# Altium schematic sheet smartGarden_COM_Rev01.SchDoc
size A
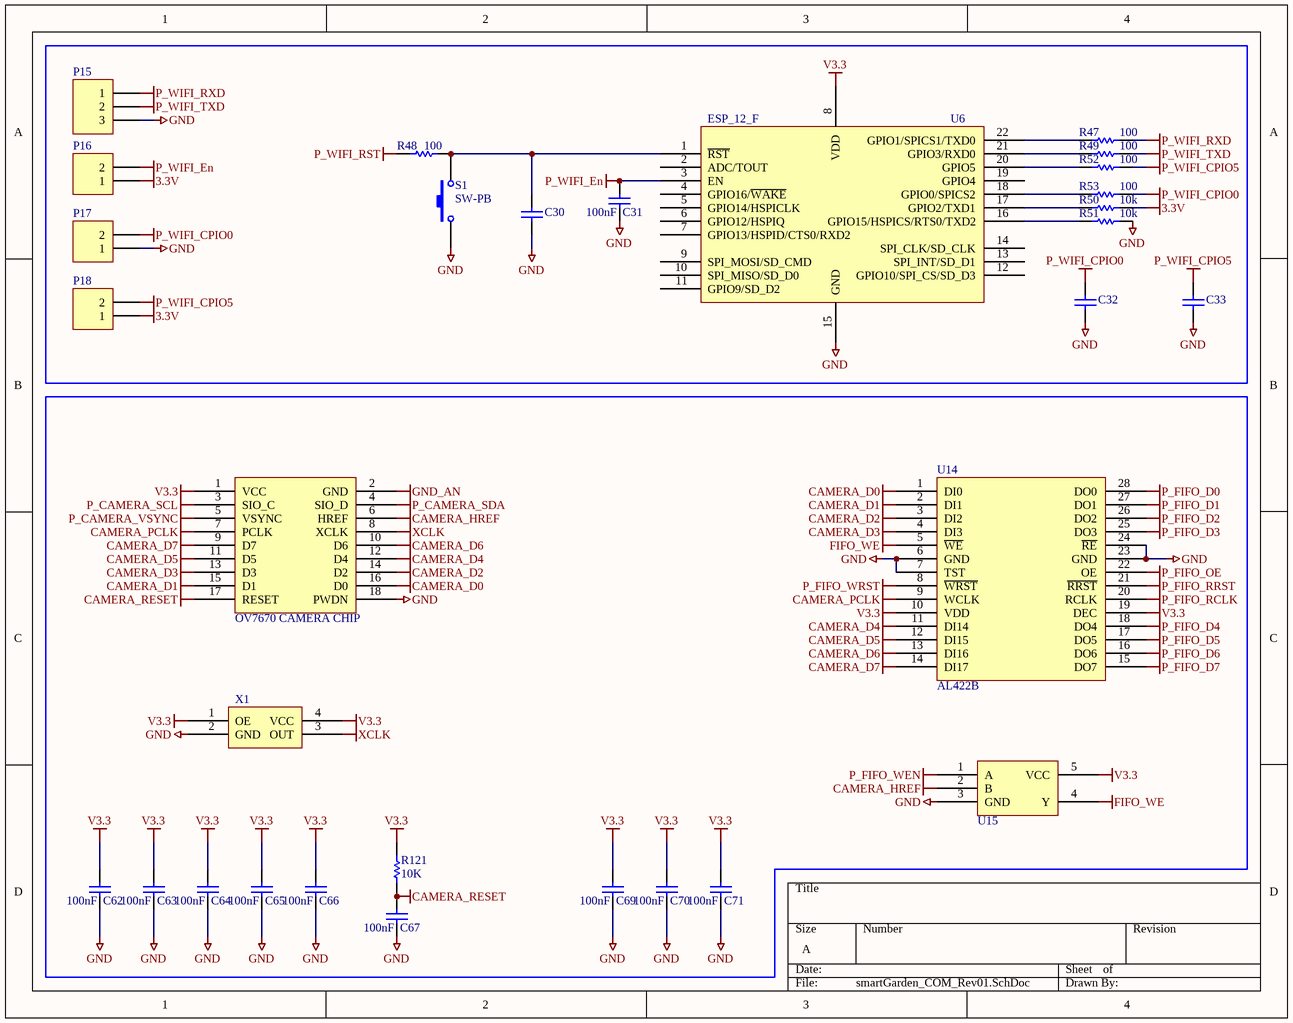
[diagram p0: smartGarden_COM_Rev01.SchDoc]

## Parts
C30  100nF_SKIP  [0805_smd]  (value not drawn)
C31  100nF  [0805_SMD]
C32  100n_skip  [0805_SMD]  (value not drawn)
C33  100n_skip  [0805_SMD]  (value not drawn)
C62  100nF  [0805_SMD]
C63  100nF  [0805_SMD]
C64  100nF  [0805_SMD]
C65  100nF  [0805_SMD]
C66  100nF  [0805_SMD]
C67  100nF  [0805_SMD]
C69  100nF  [0805_SMD]
C70  100nF  [0805_SMD]
C71  100nF  [0805_SMD]
P15  CON 1*40 PIN HEADER 5H MALE 2.54  [CON3_XH]  (value not drawn)
P16  Header 2  [HDR1X2]  (value not drawn)
P17  Header 2  [HDR1X2]  (value not drawn)
P18  Header 2  [HDR1X2]  (value not drawn)
R47  100  [0805_smd]
R48  100  [0805_smd]
R49  100  [0805_smd]
R50  10k  [0805_smd]
R51  10k  [0805_smd]
R52  100  [0805_smd]
R53  100  [0805_smd]
R121  10K  [0805_smd]
S1  SW-PB  [SW_4.5*4.5]
U6  ESP_12_F  [ESP_12_E]
U13  OV7670 CAMERA CHIP
U14  AL422B
U15  NAND  (value not drawn)
X1  4PIN OSCILLATOR  (value not drawn)

## Nets
3.3V: P16.1 P18.1 R50.1
CAMERA_D0: U13.16(D0) U14.1(DI0)
CAMERA_D1: U13.15(D1) U14.2(DI1)
CAMERA_D2: U13.14(D2) U14.3(DI2)
CAMERA_D3: U13.13(D3) U14.4(DI3)
CAMERA_D4: U13.12(D4) U14.11(DI14)
CAMERA_D5: U13.11(D5) U14.12(DI15)
CAMERA_D6: U13.10(D6) U14.13(DI16)
CAMERA_D7: U13.9(D7) U14.14(DI17)
CAMERA_HREF: U13.6(HREF) U15.2(B)
CAMERA_PCLK: U13.7(PCLK) U14.9(WCLK)
CAMERA_RESET: C67.2 R121.2 U13.17(RESET)
FIFO_WE: U14.5(~{WE}) U15.4(Y)
GND: C30.1 C31.1 C32.1 C33.1 C62.1 C63.1 C64.1 C65.1 C66.1 C67.1 C69.1 C70.1 C71.1 P15.3 P17.1 R51.1 S1.1 U6.15(GND) U13.18(PWDN) U14.6(GND) U14.7(TST) U14.23(GND) U14.24(~{RE}) U15.3(GND) X1.2(GND)
GND_AN: U13.2(GND)
P_CAMERA_SCL: U13.3(SIO_C)
P_CAMERA_SDA: U13.4(SIO_D)
P_CAMERA_VSYNC: U13.5(VSYNC)
P_FIFO_D0: U14.28(DO0)
P_FIFO_D1: U14.27(DO1)
P_FIFO_D2: U14.26(DO2)
P_FIFO_D3: U14.25(DO3)
P_FIFO_D4: U14.18(DO4)
P_FIFO_D5: U14.17(DO5)
P_FIFO_D6: U14.16(DO6)
P_FIFO_D7: U14.15(DO7)
P_FIFO_OE: U14.22(OE)
P_FIFO_RCLK: U14.20(RCLK)
P_FIFO_RRST: U14.21(~{RRST})
P_FIFO_WEN: U15.1(A)
P_FIFO_WRST: U14.8(~{WRST})
P_WIFI_CPIO0: C32.2 P17.2 R53.1
P_WIFI_CPIO5: C33.2 P18.2 R52.1
P_WIFI_En: C31.2 P16.2 U6.3(EN)
P_WIFI_RST: R48.2
P_WIFI_RXD: P15.1 R47.1
P_WIFI_TXD: P15.2 R49.1
V3.3: C62.2 C63.2 C64.2 C65.2 C66.2 C69.2 C70.2 C71.2 R121.1 U6.8(VDD) U13.1(VCC) U14.10(VDD) U14.19(DEC) U15.5(VCC) X1.1(OE) X1.4(VCC)
XCLK: U13.8(XCLK) X1.3(OUT)
NetC30_2: C30.2 R48.1 S1.2 U6.1(~{RST})
NetR47_2: R47.2 U6.22(GPIO1/SPICS1/TXD0)
NetR49_2: R49.2 U6.21(GPIO3/RXD0)
NetR50_2: R50.2 U6.17(GPIO2/TXD1)
NetR51_2: R51.2 U6.16(GPIO15/HSPICS/RTS0/TXD2)
NetR52_2: R52.2 U6.20(GPIO5)
NetR53_2: R53.2 U6.18(GPIO0/SPICS2)

Not connected (* = marked no-connect by the designer): U6 2(ADC/TOUT) 4(GPIO16/~{WAKE}) 5(GPIO14/HSPICLK) 6(GPIO12/HSPIQ) 7(GPIO13/HSPID/CTS0/RXD2) 9(SPI_MOSI/SD_CMD) 10(SPI_MISO/SD_D0) 11(GPIO9/SD_D2) 12(GPIO10/SPI_CS/SD_D3) 13(SPI_INT/SD_D1) 14(SPI_CLK/SD_CLK) 19(GPIO4)

## Library data of the parts
C30 C32 C33 = Cap Semi: Capacitor (Semiconductor SIM Model); Value: 100nF; Published: 8-Jun-2000; LatestRevisionDate: 17-Jul-2002; LatestRevisionNote: Re-released for DXP Platform.; PackageReference: C1206; Publisher: Altium Limited
C31 C62-C67 C69-C71 = Cap Semi: Capacitor (Semiconductor SIM Model); Published: 8-Jun-2000; LatestRevisionDate: 17-Jul-2002; LatestRevisionNote: Re-released for DXP Platform.; PackageReference: C1206; Publisher: Altium Limited; Value: 100nF
P15 = Header 3: Header, 3-Pin; LatestRevisionDate: 17-Jul-2002; LatestRevisionNote: Re-released for DXP Platform.; Publisher: Altium Limited
P16-P18 = Header 2: Header, 2-Pin; LatestRevisionDate: 17-Jul-2002; LatestRevisionNote: Re-released for DXP Platform.; Publisher: Altium Limited
R47-R53 R121 = Res Semi: Semiconductor Resistor; Value: 1k; Published: 8-Jun-2000; LatestRevisionDate: 17-Jul-2002; LatestRevisionNote: Re-released for DXP Platform.; PackageReference: AXIAL-0.5; Publisher: Altium Limited
S1 = SW-PB: Switch; Published: 24-Mar-1999; LatestRevisionDate: 17-Jul-2002; LatestRevisionNote: Re-released for DXP Platform.; PackageReference: SPST-2; Publisher: Altium Limited
U6 = ESP_12_E: ESP-12 Wi-Fi Module by AI-Thinker; IC: ESP8266-EX; Vendor: Ai-thinker
U15 = SN74LVC1G00